# Altium schematic sheet Battery_Protection.SchDoc
size 297 x 209 mm; SheetNumber: 3; SheetTotal: 9
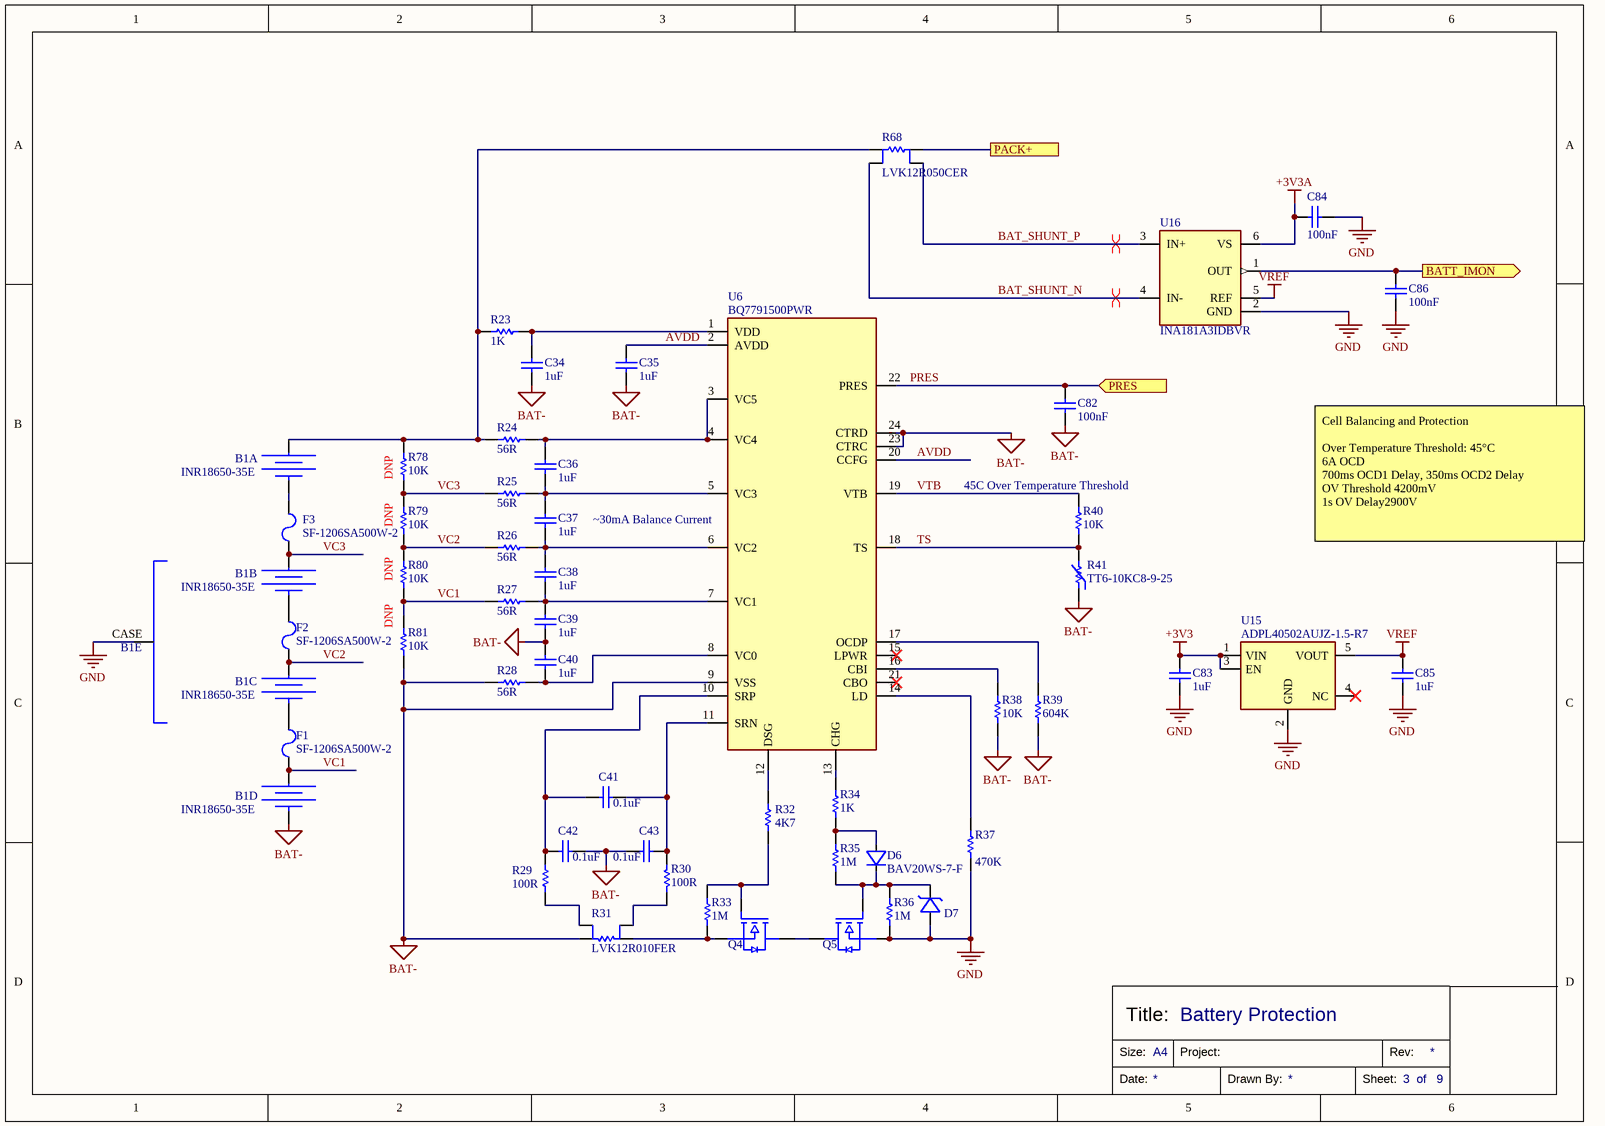
[diagram p0: Battery_Protection.SchDoc]

## Parts
B1  INR18650-35E  [4S Battery Direct Solder]  (parts A,B,C,D,E of 5)
C34  Capacitance: 1uF  [CAPC0603X040]  (hidden comment: CL10A105KB8NNNC)
C35  Capacitance: 1uF  [CAPC0603X040]  (hidden comment: CL10A105KB8NNNC)
C36  Capacitance: 1uF  [CAPC0603X040]  (hidden comment: CL10A105KB8NNNC)
C37  Capacitance: 1uF  [CAPC0603X040]  (hidden comment: CL10A105KB8NNNC)
C38  Capacitance: 1uF  [CAPC0603X040]  (hidden comment: CL10A105KB8NNNC)
C39  Capacitance: 1uF  [CAPC0603X040]  (hidden comment: CL10A105KB8NNNC)
C40  Capacitance: 1uF  [CAPC0603X040]  (hidden comment: CL10A105KB8NNNC)
C41  Capacitance: 0.1uF  [CAPC0402X020]  (hidden comment: CL05B104KB5NNNC)
C42  Capacitance: 0.1uF  [CAPC0402X020]  (hidden comment: CL05B104KB5NNNC)
C43  Capacitance: 0.1uF  [CAPC0402X020]  (hidden comment: CL05B104KB5NNNC)
C82  Capacitance: 100nF  [CAPC0603X040]  (hidden comment: C0603C104K5RACTU)
C83  Capacitance: 1uF  [CAPC0603X040]  (hidden comment: CL10A105KB8NNNC)
C84  Capacitance: 100nF  [CAPC0603X040]  (hidden comment: C0603C104K5RACTU)
C85  Capacitance: 1uF  [CAPC0603X040]  (hidden comment: CL10A105KB8NNNC)
C86  Capacitance: 100nF  [CAPC0603X040]  (hidden comment: C0603C104K5RACTU)
D6  BAV20WS-7-F  [SOD-323]
D7  BZT52C12T-7  [SOD-523]  (value not drawn)
F1  SF-1206SA500W-2  [SF-1206SA300W-2]
F2  SF-1206SA500W-2  [SF-1206SA300W-2]
F3  SF-1206SA500W-2  [SF-1206SA300W-2]
Q4  BSC026N08NS5  [PG-TDSON-8-5]  (value not drawn)
Q5  BSC026N08NS5  [PG-TDSON-8-5]  (value not drawn)
R23  Resistance: 1K  [RESC0603]  (hidden comment: RMCF0603FT1K00)
R24  Resistance: 56R  [RESC0603]  (hidden comment: RMCF0603FT56R0)
R25  Resistance: 56R  [RESC0603]  (hidden comment: RMCF0603FT56R0)
R26  Resistance: 56R  [RESC0603]  (hidden comment: RMCF0603FT56R0)
R27  Resistance: 56R  [RESC0603]  (hidden comment: RMCF0603FT56R0)
R28  Resistance: 56R  [RESC0603]  (hidden comment: RMCF0603FT56R0)
R29  Resistance: 100R  [RESC0603]  (hidden comment: RMCF0603FT100R)
R30  Resistance: 100R  [RESC0603]  (hidden comment: RMCF0603FT100R)
R31  LVK12R010FER  [LVK12R050CER-2]
R32  Resistance: 4K7  [RESC0603]  (hidden comment: RMCF0603FT4K7)
R33  Resistance: 1M  [RESC0603]  (hidden comment: RMCF0603FT1M00)
R34  Resistance: 1K  [RESC0603]  (hidden comment: RMCF0603FT1K00)
R35  Resistance: 1M  [RESC0603]  (hidden comment: RMCF0603FT1M00)
R36  Resistance: 1M  [RESC0603]  (hidden comment: RMCF0603FT1M00)
R37  Resistance: 470K  [RESC0603]  (hidden comment: RMCF0603FT470K)
R38  Resistance: 10K  [RESC0603]  (hidden comment: RMCF0603FT10K0)
R39  Resistance: 604K  [RESC0603]  (hidden comment: RMCF0603FT604K)
R40  Resistance: 10K  [RESC0603]  (hidden comment: RMCF0603FT10K0)
R41  TT6-10KC8-9-25  [TT6-10KC8-9-25]
R68  LVK12R050CER  [LVK12R050CER-2]
R78  Resistance: 10K  [RESC0603]  (hidden comment: RMCF0603FT10K0)
R79  Resistance: 10K  [RESC0603]  (hidden comment: RMCF0603FT10K0)
R80  Resistance: 10K  [RESC0603]  (hidden comment: RMCF0603FT10K0)
R81  Resistance: 10K  [RESC0603]  (hidden comment: RMCF0603FT10K0)
U6  BQ7791500PWR  [TSSOP-24]
U15  ADPL40502AUJZ-1.5-R7  [SOT23-5 IC]
U16  INA181A3IDBVR  [SOT23-6 IC]

## Ports
BATT_IMON (out, see Power_Path[4C], Controller[2C]), PACK+ (see Power_Path[4B]), PRES (in, see Power_Path[4C])

## Nets
+3V3: C83.2 U15.1(VIN) U15.3(EN)
+3V3A: C84.1 U16.6(VS)
BAT-: B1.7 C34.1 C35.1 C39.1 C40.2 C42.2 C43.1 C82.1 R28.1 R31.1 R38.1 R39.1 R41.1 R81.1 U6.9(VSS) U6.23(CTRC) U6.24(CTRD)
GND: B1.CASE C83.1 C84.2 C85.1 C86.1 D7.A Q5.S R36.1 R37.1 U15.2(GND) U16.2(GND)
VREF: C85.2 U15.5(VOUT) U16.5(REF)
AVDD: C35.2 U6.2(AVDD) U6.20(CCFG)
BAT_SHUNT_N: R68.2 U16.4(IN-)
BAT_SHUNT_P: R68.3 U16.3(IN+)
BATT_IMON: C86.2 U16.1(OUT) ; port BATT_IMON
PACK+: R68.4 ; port PACK+
PRES: C82.2 U6.22(PRES) ; port PRES
TS: R40.1 R41.2 U6.18(TS)
VC1: B1.8 F1.1 R27.1 R80.1 R81.2
VC2: B1.6 F2.1 R26.1 R79.1 R80.2
VC3: B1.4 F3.1 R25.1 R78.1 R79.2
VTB: R40.2 U6.19(VTB)
NetB1_1: B1.1 F3.2
NetB1_2: B1.2 R23.1 R24.1 R68.1 R78.2
NetB1_3: B1.3 F2.2
NetB1_5: B1.5 F1.2
NetC34_2: C34.2 R23.2 U6.1(VDD)
NetC36_1: C36.1 C37.2 R25.2 U6.5(VC3)
NetC36_2: C36.2 R24.2 U6.3(VC5) U6.4(VC4)
NetC37_1: C37.1 C38.2 R26.2 U6.6(VC2)
NetC38_1: C38.1 C39.2 R27.2 U6.7(VC1)
NetC40_1: C40.1 R28.2 U6.8(VC0)
NetC41_1: C41.1 C42.1 R29.2 U6.10(SRP)
NetC41_2: C41.2 C43.2 R30.2 U6.11(SRN)
NetD6_A: D6.A R34.1 R35.2
NetD6_K: D6.K D7.K Q5.G R35.1 R36.2
NetQ4_D: Q4.D Q5.D
NetQ4_G: Q4.G R32.1 R33.2
NetQ4_S: Q4.S R31.4 R33.1
NetR29_1: R29.1 R31.2
NetR30_1: R30.1 R31.3
NetR32_2: R32.2 U6.12(DSG)
NetR34_2: R34.2 U6.13(CHG)
NetR37_2: R37.2 U6.14(LD)
NetR38_2: R38.2 U6.16(CBI)
NetR39_2: R39.2 U6.17(OCDP)

Not connected (* = marked no-connect by the designer): U6 15(LPWR)* 21(CBO)*; U15 4(NC)*

## Layout directives
differential pair: BAT_SHUNT_N, BAT_SHUNT_P

## Notes on the sheet
- (near R78) DNP
- (near R79) DNP
- (near U6) ~30mA Balance Current
- (near R40) 45C Over Temperature Threshold
- Cell Balancing and Protection
  Over Temperature Threshold: 45°C
  6A OCD
  700ms OCD1 Delay, 350ms OCD2 Delay
  OV Threshold 4200mV
  1s OV Delay2900V
- (near R80) DNP
- (near R81) DNP
- Battery Protection
- Size:
- Title:
- A4
- Project:
- Rev:
- Date:
- Drawn By:
- Sheet:
- of

## Library data of the parts
B1 = 4S Battery Split: Custom 4S battery component for Cubesat EPS; Part Number: N/A; Distributor Part Number: N/A
C34-C40 C83 C85 = CL10A105KB8NNNC: 1uF 50V X5R ±10% 0603 Multilayer Ceramic Capacitors MLCC - SMD/SMT ROHS; Part Number: CL10A105KB8NNNC; Tolerance: 10%; Distributor Part number: C15849; Case Code: 0603; Distributor: JLCPCB; Dielectric: X5R; Voltage Rating: 50V
C41-C43 = CL05B104KB5NNNC: 0.1 µF ±10% 50V Ceramic Capacitor X7R 0402 (1005 Metric); Part Number: CL05B104KB5NNNC; Tolerance: 10%; Distributor Part Number: 1276-CL05B104KB5NNNCCT-ND; Case Code: 0402; Distributor: Digikey; Voltage Rating: 50V
C82 C84 C86 = C0603C104K5RACTU: 0.1 µF ±10% 50V Ceramic Capacitor X7R 0603 (1608 Metric); Part Number: C0603C104K5RACTU; Tolerance: 10%; Distributor Part Number: 399-C0603C104K5RACTUCT-ND; Case Code: 0603; Distributor: Digikey; Voltage Rating: 50V
D6 = BAV20WS-7-F0: Small Signal Switching Diode 150V 200mW; Vr (Max): 200; Ir (Max): 100n; Ifsm: 3@100us; Operating Temperature: -55 to 150C; Part Number: BAV20WS-7-F; Distributor: Digikey; Distributor Part Number: BAV20WS-FDICT-ND
D7 = BZT52C12T-7: Zener Diode 12 V 300 mW ±5% Surface Mount SOD-523; Voltage - Zener: 12V; Power - Max: 300mW; Part Number: BZT52C12T-7; Distributor Part Number: 621-BZT52C12T-7; Operating Temperature: -65°C ~ 150°C; Distributor: Mouser
F1-F3 = SF-1206SA300W-2: Fuse Surface Mount 5A Slow Blow 50A Interrupt 1206; Interrupt Rating: 50A at 125VAC 50A at 125VDC; Fuse Size: 9.73 mm x 5.03 mm; Min Temperature: -55C; Max Temperature: 125C; Voltage Rating - DC: 65V; Current Rating: 5A; Distributor: Digikey; Distributor Part Number: 118-SF-1206SA500W-2CT-ND; Breaking Capacity: 50A; Part Number: SF-1206SA500W-2
Q4 Q5 = BSC026N08NS5: 80V N-Channel 23A (Ta), 100A (Tc) 2.5W (Ta), 156W (Tc) Surface Mount PG-TDSON-8-6; Vgs (Max): 20; Vds (Max): 4; Qg: 92nC@10V; Vth: 3.8V; Id: 23; Power Dissipation: 3.1W; Drive Voltage: 6V~10V; Rds On (Max) @ Id, Vgs: 2.6mOhm @ 50A, 10V; Manufacturer Part Number: BSC026N08NS5; Distributor Part Number: 726-BSC026N08NS5ATMA; Distributor: Mouser; Operating Temperature: -55°C ~ 150°C (TJ); Power Dissipation (Max): 2.5W (Ta), 156W (Tc)
R23 R34 = RMCF0603FT1K00: 1 kOhms ±1% 0.1W, 1/10W Chip Resistor 0603 (1608 Metric) Automotive AEC-Q200 Thick Film; Part Number: RMCF0603FT1K00; Tolerance: 1%; Distributor Part Number: RMCF0603FT1K00CT-ND; Distributor: Digikey; Case Code: 0603
R24-R28 = RMCF0603FT56R0: 56 Ohms ±1% 0.1W, 1/10W Chip Resistor 0603 (1608 Metric) Automotive AEC-Q200 Thick Film; Part Number: RMCF0603FT56R0; Tolerance: 1%; Distributor Part Number: RMCF0603FT56R0CT-ND; Distributor: Digikey; Case Code: 0603
R29 R30 = RMCF0603FT100R: 100 Ohms ±1% 0.1W, 1/10W Chip Resistor 0603 (1608 Metric) Automotive AEC-Q200 Thick Film; Part Number: RMCF0603FT100R; Tolerance: 1%; Distributor Part Number: RMCF0603FT100RCT-ND; Distributor: Digikey; Case Code: 0603
R31 = LVK12R010FER: 10 mOhms ±1% 0.5W, 1/2W Chip Resistor 1206 (3216 Metric) Anti-Corrosive, Current Sense, Moisture Resistant Thick Film; Manufacturer: Ohmite; Tolerance: 0.25%; Temperature Coefficient: ±50ppm/°C; Resistance: 10mOhm; Part Number: LVK12R010FER; Distributor: Digikey; Distributor Part Number: 273-LVK12R010FERCT-ND; Power: 0.5W
R32 = RMCF0603FT4K7: 4.7 kOhms ±1% 0.1W, 1/10W Chip Resistor 0603 (1608 Metric) Automotive AEC-Q200 Thick Film; Part Number: RMCF0603FT4K7; Tolerance: 1%; Distributor Part Number: RMCF0603FT4K70CT-ND; Distributor: Digikey; Case Code: 0603
R33 R35 R36 = RMCF0603FT1M00: 1 MOhms ±1% 0.1W, 1/10W Chip Resistor 0603 (1608 Metric) Automotive AEC-Q200 Thick Film; Part Number: RMCF0603FT1M00; Tolerance: 1%; Distributor Part Number: RMCF0603FT1M00CT-ND; Distributor: Digikey; Case Code: 0603
R37 = RMCF0603FT470K: 470 kOhms ±1% 0.1W, 1/10W Chip Resistor 0603 (1608 Metric) Automotive AEC-Q200 Thick Film; Part Number: RMCF0603FT470K; Tolerance: 1%; Distributor Part Number: RMCF0603FT470KCT-ND; Distributor: Digikey; Case Code: 0603
R38 R40 R78-R81 = RMCF0603FT10K0: 10 kOhms ±1% 0.1W, 1/10W Chip Resistor 0603 (1608 Metric) Automotive AEC-Q200 Thick Film; Part Number: RMCF0603FT10K0; Tolerance: 1%; Distributor: Digikey; Distributor Part Number: RMCF0603FT10K0CT-ND; Case Code: 0603
R39 = RMCF0603FT604K: 604 kOhms ±1% 0.1W, 1/10W Chip Resistor 0603 (1608 Metric) Automotive AEC-Q200 Thick Film; Part Number: RMCF0603FT604K; Tolerance: 1%; Distributor Part Number: RMCF0603FT604KCT-ND; Distributor: Digikey; Case Code: 0603
R41 = TT6-10KC8-9-25: NTC Thermistor 10k Probe; Part Number: TT6-10KC8-9-25; Distributor Part Number: 1912-TT6-10KC8-9-25-ND; Distributor: Digikey; Operating Temperature: -30°C ~ 120°C; Resistance @ 25C: 10k
R68 = LVK12R050CER: Resistor, Current Sense 50 mOhms ±0.25% 0.5W, Moisture Resistant Thick Film; Manufacturer: Ohmite; Temperature Coefficient: ±50ppm/°C; Resistance: 50mOhm; Part Number: LVK12R050CER; Distributor: Mouser; Distributor Part Number: 588-LVK12R050CER; Power: 0.5W; Tolerance: 0.25%
U6 = BQ7791500PWR: Battery Battery Protection IC Lithium Ion/Polymer 24-TSSOP; OV Threshold: 4200mV; OV Delay: 1s; UV Threshold: 2900mV; Part Number: BQ7791500PWR; Distributor: Digikey; Distributor Part Number: 296-50995-1-ND; Operating Temperature: -25C~85C; UV Delay: 1s
U15 = ADPL40502AUJZ-1.5-R7: Linear Voltage Regulator IC Positive Fixed 1.5V Output 200mA TSOT-23-5; Voltage Dropout (Max): 0.23V @ 200mA; Voltage - Input (Max): 5.5V; Part Number: ADPL40502AUJZ-1.5-R7; Distributor: Digikey; Distributor Part Number: 505-ADPL40502AUJZ-1.5-R7CT-ND; Operating Temperature: -40°C ~ 125°C (TA); Current - Output: 200mA; Voltage Output: 1.5V
U16 = INA181A3IDBVR: Current Sense Amplifier Bidirectional 100V/V; Accuracy: 0.5%; Distributor: Digikey; Distributor Part Number: 296-47658-1-ND; Operating Temperature: -40°C ~ 125°C; Part Number: INA181A3IDBVR; Gain: 100V/V